# Altium schematic sheet Fuel Gauge.SchDoc
size A4; SheetNumber: 2; SheetTotal: 3
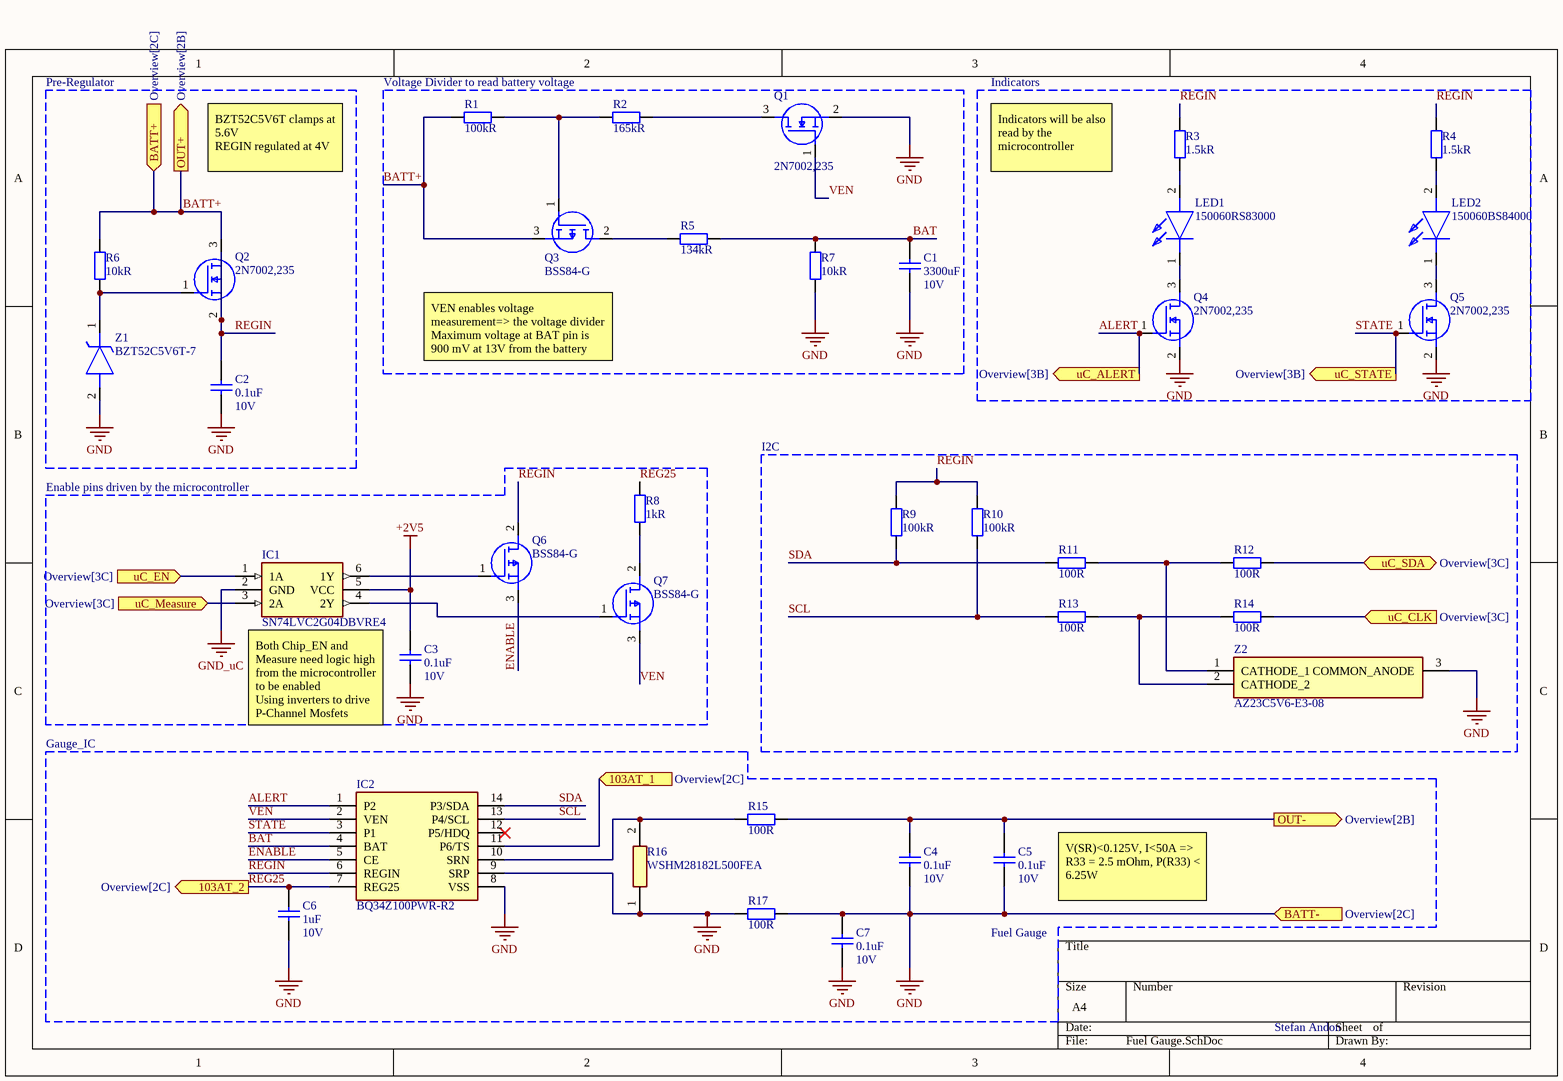
[diagram p0: Fuel Gauge.SchDoc]

## Parts
C1  value 3300uF  Voltage: 10V  [CAP_0603]  (hidden comment: Capacitor_SMD)
C2  value 0.1uF  Voltage: 10V  [CAP_0603]  (hidden comment: Capacitor_SMD)
C3  value 0.1uF  Voltage: 10V  [CAP_0603]  (hidden comment: Capacitor_SMD)
C4  value 0.1uF  Voltage: 10V  [CAP_0603]  (hidden comment: Capacitor_SMD)
C5  value 0.1uF  Voltage: 10V  [CAP_0603]  (hidden comment: Capacitor_SMD)
C6  value 1uF  Voltage: 10V  [CAP_0603]  (hidden comment: Capacitor_SMD)
C7  value 0.1uF  Voltage: 10V  [CAP_0603]  (hidden comment: Capacitor_SMD)
IC1  SN74LVC2G04DBVRE4  [SOT95P280X145-6N]
IC2  BQ34Z100PWR-R2  [SOP65P640X120-14N]
LED1  150060RS83000  [LEDC1608X115N]
LED2  150060BS84000  [LEDC1608X105N]
Q1  2N7002,235  [SOT95P230X110-3N]
Q2  2N7002,235  [SOT95P230X110-3N]
Q3  BSS84-G  [SOT95P240X120-3N]
Q4  2N7002,235  [SOT95P230X110-3N]
Q5  2N7002,235  [SOT95P230X110-3N]
Q6  BSS84-G  [SOT95P240X120-3N]
Q7  BSS84-G  [SOT95P240X120-3N]
R1  value 100kR  [RES_1206]  (hidden comment: Resistor_SMD)
R2  value 165kR  [RES_1206]  (hidden comment: Resistor_SMD)
R3  value 1.5kR  [RES_1206]  (hidden comment: Resistor_SMD)
R4  value 1.5kR  [RES_1206]  (hidden comment: Resistor_SMD)
R5  value 134kR  [RES_1206]  (hidden comment: Resistor_SMD)
R6  value 10kR  [RES_1206]  (hidden comment: Resistor_SMD)
R7  value 10kR  [RES_1206]  (hidden comment: Resistor_SMD)
R8  value 1kR  [RES_1206]  (hidden comment: Resistor_SMD)
R9  value 100kR  [RES_1206]  (hidden comment: Resistor_SMD)
R10  value 100kR  [RES_1206]  (hidden comment: Resistor_SMD)
R11  value 100R  [RES_1206]  (hidden comment: Resistor_SMD)
R12  value 100R  [RES_1206]  (hidden comment: Resistor_SMD)
R13  value 100R  [RES_1206]  (hidden comment: Resistor_SMD)
R14  value 100R  [RES_1206]  (hidden comment: Resistor_SMD)
R15  value 100R  [RES_1206]  (hidden comment: Resistor_SMD)
R16  WSHM28182L500FEA  [WSHM28182L500FEA]
R17  value 100R  [RES_1206]  (hidden comment: Resistor_SMD)
Z1  BZT52C5V6T-7  [BZT52C5V6T7]
Z2  AZ23C5V6-E3-08  [SOT95P248X115-3N]

## Blocks framed on the sheet
Pre-Regulator: C2 Q2 R6 Z1
Voltage Divider to read battery voltage: C1 Q1 Q3 R1 R2 R5 R7
Indicators: LED1 LED2 Q4 Q5 R3 R4
I2C: R9-R14 Z2

## Ports
103AT_1 (in, see Overview[2C]), 103AT_2 (out, see Overview[2C]), BATT+ (in, see Overview[2C]), BATT- (in, see Overview[2C]), OUT+ (out, see Overview[2B]), OUT- (out, see Overview[2B]), uC_ALERT (out, see Overview[3B]), uC_CLK (in, see Overview[3C]), uC_EN (in, see Overview[3C]), uC_Measure (in, see Overview[3C]), uC_SDA (bidir, see Overview[3C]), uC_STATE (out, see Overview[3B])

## Nets
+2V5: C3.2 IC1.5(VCC)
GND: C1.1 C2.1 C3.1 C4.1 C5.1 C6.1 C7.1 C7.2 IC2.8(VSS) IC2.9(SRP) Q1.2(S) Q4.2(S) Q5.2(S) R7.1 R16.1 R17.1 R17.2 Z1.2(A) Z2.3(COMMON_ANODE) ; port BATT-
GND_uC: IC1.2(GND)
103AT_1: IC2.11(P6/TS) ; port 103AT_1
ALERT: IC2.1(P2) Q4.1(G) ; port uC_ALERT
BAT: C1.2 IC2.4(BAT) R5.2 R7.2
BATT+: Q2.3(D) Q3.3(S) R1.1 R6.1 ; port BATT+, port OUT+
ENABLE: IC2.5(CE) Q6.3(S)
OUT-: C4.2 C5.2 R15.1 ; port OUT-
REG25: C6.2 IC2.7(REG25) R8.2 ; port 103AT_2
REGIN: C2.2 IC2.6(REGIN) Q2.2(S) Q6.2(D) R3.2 R4.2 R9.2 R10.2
SCL: IC2.13(P4/SCL) R10.1 R13.2
SDA: IC2.14(P3/SDA) R9.1 R11.2
STATE: IC2.3(P1) Q5.1(G) ; port uC_STATE
uC_CLK: R14.1 ; port uC_CLK
uC_EN: IC1.1(1A) ; port uC_EN
uC_Measure: IC1.3(2A) ; port uC_Measure
uC_SDA: R12.1 ; port uC_SDA
VEN: IC2.2(VEN) Q1.1(G) Q7.3(S)
NetIC1_4: IC1.4(2Y) Q7.1(G)
NetIC1_6: IC1.6(1Y) Q6.1(G)
NetIC2_10: IC2.10(SRN) R15.2 R16.2
NetLED1_1: LED1.1(K) Q4.3(D)
NetLED1_2: LED1.2(A) R3.1
NetLED2_1: LED2.1(K) Q5.3(D)
NetLED2_2: LED2.2(A) R4.1
NetQ1_3: Q1.3(D) R2.2
NetQ2_1: Q2.1(G) R6.2 Z1.1(K)
NetQ3_1: Q3.1(G) R1.2 R2.1
NetQ3_2: Q3.2(D) R5.1
NetQ7_2: Q7.2(D) R8.1
NetR11_1: R11.1 R12.2 Z2.1(CATHODE_1)
NetR13_1: R13.1 R14.2 Z2.2(CATHODE_2)

Not connected (* = marked no-connect by the designer): IC2 12(P5/HDQ)*

## Notes on the sheet
- BZT52C5V6T clamps at 5.6V
  REGIN regulated at 4V
- Indicators will be also read by the microcontroller
- VEN enables voltage measurement=> the voltage divider
  Maximum voltage at BAT pin is 900 mV at 13V from the battery
- Enable pins driven by the microcontroller
- Gauge_IC
- Both Chip_EN and Measure need logic high from the microcontroller to be enabled
  Using inverters to drive P-Channel Mosfets
- V(SR)<0.125V, I<50A => R33 = 2.5 mOhm, P(R33) < 6.25W
- Fuel Gauge
- Stefan Andon

## Library data of the parts
C1 = CMP-001-0004-13: SMD Capacitor; Tolerance: tbd; BOM: 3300uF, 10V, tbd, tbd,CAP_0603; Dielectric: tbd; Package: tbd
C2-C5 C7 = CMP-001-0004-13: SMD Capacitor; Tolerance: tbd; BOM: 0.1uF, 10V, tbd, tbd,CAP_0603; Dielectric: tbd; Package: tbd
C6 = CMP-001-0004-13: SMD Capacitor; Tolerance: tbd; BOM: 1uF, 10V, tbd, tbd,CAP_0603; Dielectric: tbd; Package: tbd
IC1 = SN74LVC2G04DBVRE4: Integrated Circuit; Manufacturer_Name: Texas Instruments; Datasheet Link: https://www.arrow.com/en/products/sn74lvc2g04dbvre4/texas-instruments; Height: 1.45mm; Manufacturer_Part_Number: SN74LVC2G04DBVRE4; Mouser Part Number: 595-SN74LVC2G04DBVRE; Mouser Price/Stock: https://www.mouser.co.uk/ProductDetail/Texas-Instruments/SN74LVC2G04DBVRE4?qs=PVVDbbWpW3Jcz3iqyBLxqA%3D%3D; Arrow Part Number: SN74LVC2G04DBVRE4; Arrow Price/Stock: https://www.arrow.com/en/products/sn74lvc2g04dbvre4/texas-instruments?utm_currency=USD&region=nac
IC2 = BQ34Z100PWR-R2: Integrated Circuit; Manufacturer_Name: Texas Instruments; Datasheet Link: https://www.arrow.com/en/products/bq34z100pwr-r2/texas-instruments?region=nac; Height: 1.2mm; Manufacturer_Part_Number: BQ34Z100PWR-R2; Mouser Part Number: 595-BQ34Z100PWR-R2; Mouser Price/Stock: https://www.mouser.co.uk/ProductDetail/Texas-Instruments/BQ34Z100PWR-R2?qs=rQFj71Wb1eWspkgmxcmVcA%3D%3D; Arrow Part Number: BQ34Z100PWR-R2; Arrow Price/Stock: https://www.arrow.com/en/products/bq34z100pwr-r2/texas-instruments?utm_currency=USD&region=nac
LED1 = 150060RS83000: LED; Manufacturer_Name: Wurth Elektronik; Datasheet Link: https://www.mouser.com/datasheet/2/445/150060RS86000-1838740.pdf; Height: 1.15mm; Manufacturer_Part_Number: 150060RS83000
LED2 = 150060BS84000: LED; Manufacturer_Name: Wurth Elektronik; Datasheet Link: https://componentsearchengine.com/Datasheets/2/150060BS84000.pdf; Height: 1.05mm; Manufacturer_Part_Number: 150060BS84000; Mouser Part Number: 710-150060BS84000; Mouser Price/Stock: https://www.mouser.co.uk/ProductDetail/Wurth-Elektronik/150060BS84000?qs=GedFDFLaBXH%2FqfYoSeFEow%3D%3D
Q1 Q2 Q4 Q5 = 2N7002,235: MOSFET (N-Channel); Manufacturer_Name: Nexperia; Datasheet Link: https://assets.nexperia.com/documents/data-sheet/2N7002.pdf; Height: 1.1mm; Manufacturer_Part_Number: 2N7002,235; Mouser Part Number: 771-2N7002235; Mouser Price/Stock: https://www.mouser.co.uk/ProductDetail/Nexperia/2N7002235?qs=AX3SRYwdf7Gv59FeQZ%2FkYw%3D%3D; Arrow Part Number: 2N7002,235; Arrow Price/Stock: https://www.arrow.com/en/products/2n7002235/nexperia?utm_currency=USD&region=europe
Q3 Q6 Q7 = BSS84-G: MOSFET (P-Channel); Manufacturer_Name: onsemi; Datasheet Link: https://componentsearchengine.com/Datasheets/1/BSS84-G.pdf; Height: 1.2mm; Manufacturer_Part_Number: BSS84-G; Mouser Part Number: 863-BSS84-G; Mouser Price/Stock: https://www.mouser.co.uk/ProductDetail/onsemi/BSS84-G?qs=UkDUCjYnTB2fT1WGeui6RQ%3D%3D
R1-R15 R17 = CMP-001-0003-18: Tolerance: tbd; Power: 7W; BOM: Value+', '+Power+', '+Tolerance+', '+CurrentFootprint; Package: tbd
R16 = WSHM28182L500FEA: Resistor; Manufacturer_Name: Vishay; Datasheet Link: https://www.vishay.com/doc?30188; Height: 1.75mm; Manufacturer_Part_Number: WSHM28182L500FEA; Mouser Part Number: 71-WSHM28182L500FEA; Mouser Price/Stock: https://www.mouser.co.uk/ProductDetail/Vishay-Dale/WSHM28182L500FEA?qs=Blj4iBE%2FJuPIwDroY2n%2Fgg%3D%3D
Z1 = BZT52C5V6T-7: Zener Diode; Manufacturer_Name: Diodes Incorporated; Datasheet Link: https://www.diodes.com/datasheet/download/BZT52CxxT.pdf; Height: 0.65mm; Manufacturer_Part_Number: BZT52C5V6T-7; Mouser Part Number: 621-BZT52C5V6T-7; Mouser Price/Stock: https://www.mouser.co.uk/ProductDetail/Diodes-Incorporated/BZT52C5V6T-7?qs=zLeapIUCO8Tm%252BIuaCPAdkQ%3D%3D; Arrow Part Number: BZT52C5V6T-7; Arrow Price/Stock: https://www.arrow.com/en/products/bzt52c5v6t-7/diodes-incorporated?region=nac
Z2 = AZ23C5V6-E3-08: Zener Diode; Manufacturer_Name: Vishay; Datasheet Link: https://www.vishay.com/docs/85759/az23.pdf; Height: 1.15mm; Manufacturer_Part_Number: AZ23C5V6-E3-08; Mouser Part Number: 78-AZ23C5V6-E3-08; Mouser Price/Stock: https://www.mouser.co.uk/ProductDetail/Vishay-Semiconductors/AZ23C5V6-E3-08?qs=KP8Io%2FXyE5TgneZJwqz1XQ%3D%3D; Arrow Part Number: AZ23C5V6-E3-08; Arrow Price/Stock: https://www.arrow.com/en/products/az23c5v6-e3-08/vishay?utm_currency=USD&region=nac